# EAGLE design sub (EAGLE 9.6.2)
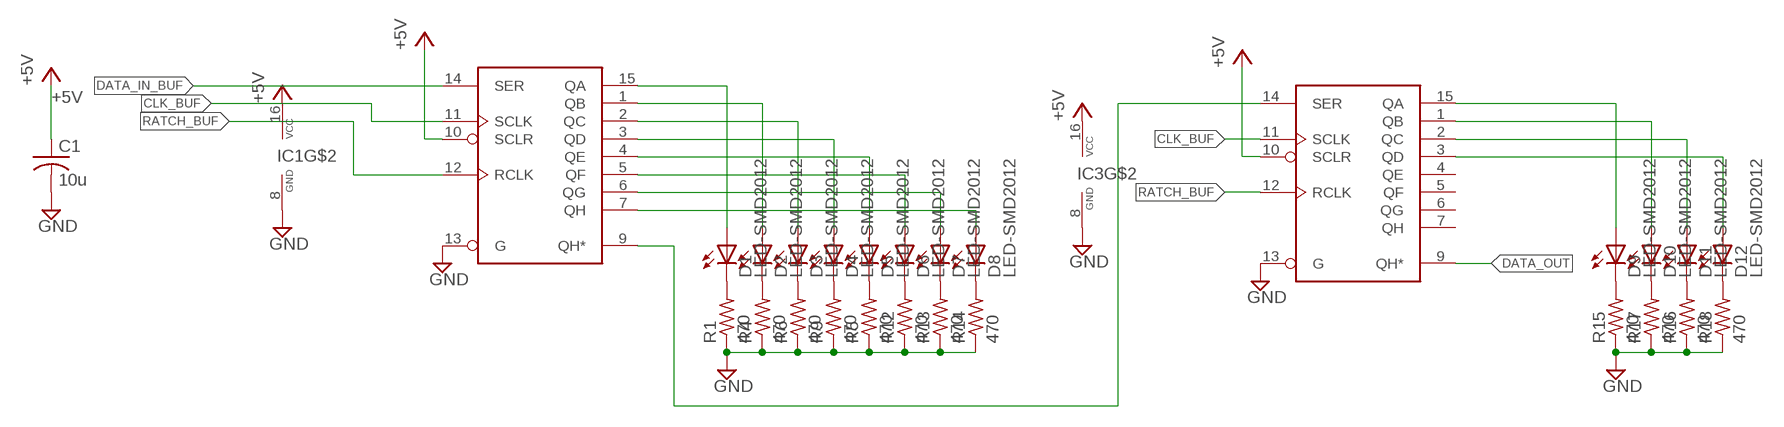
[diagram p0: schematic, sheet 1]

## Parts
C1  10u  C-2012  [2012-C]
D1  LED-SMD2012  [D2012]
D2  LED-SMD2012  [D2012]
D3  LED-SMD2012  [D2012]
D4  LED-SMD2012  [D2012]
D5  LED-SMD2012  [D2012]
D6  LED-SMD2012  [D2012]
D7  LED-SMD2012  [D2012]
D8  LED-SMD2012  [D2012]
D9  LED-SMD2012  [D2012]
D10  LED-SMD2012  [D2012]
D11  LED-SMD2012  [D2012]
D12  LED-SMD2012  [D2012]
IC1  74595AP  [SOP16]
IC3  74595AP  [SOP16]
R1  470  R-2012  [2012-R]
R4  470  R-2012  [2012-R]
R5  470  R-2012  [2012-R]
R6  470  R-2012  [2012-R]
R9  470  R-2012  [2012-R]
R12  470  R-2012  [2012-R]
R13  470  R-2012  [2012-R]
R14  470  R-2012  [2012-R]
R15  470  R-2012  [2012-R]
R16  470  R-2012  [2012-R]
R17  470  R-2012  [2012-R]
R18  470  R-2012  [2012-R]

## Nets
+5V: C1.1 IC1.10(SCLR) IC1.16(VCC) IC3.10(SCLR) IC3.16(VCC)
CLK_BUF: IC1.11(SCLK) IC3.11(SCLK)
DATA_IN_BUF: IC1.14(SER)
DATA_OUT: IC3.9(QH*)
GND: C1.2 IC1.8(GND) IC1.13(G) IC3.8(GND) IC3.13(G) R1.1 R4.1 R5.1 R6.1 R9.1 R12.1 R13.1 R14.1 R15.1 R16.1 R17.1 R18.1
N$1: D1.K R1.2
N$6: D5.K R5.2
N$7: D2.K R4.2
N$8: D3.K R6.2
N$12: D4.K R9.2
N$13: D6.K R12.2
N$14: D7.K R13.2
N$15: D8.K R14.2
N$16: D1.A IC1.15(QA)
N$17: D2.A IC1.1(QB)
N$18: D3.A IC1.2(QC)
N$19: D4.A IC1.3(QD)
N$20: D5.A IC1.4(QE)
N$21: D6.A IC1.5(QF)
N$22: D7.A IC1.6(QG)
N$23: D8.A IC1.7(QH)
N$24: D9.K R15.2
N$25: D10.K R17.2
N$26: D11.K R16.2
N$27: D12.K R18.2
N$28: D9.A IC3.15(QA)
N$29: D10.A IC3.1(QB)
N$30: D11.A IC3.2(QC)
N$31: D12.A IC3.3(QD)
N$32: IC1.9(QH*) IC3.14(SER)
RATCH_BUF: IC1.12(RCLK) IC3.12(RCLK)
Unconnected: IC3.4(QE) IC3.5(QF) IC3.6(QG) IC3.7(QH)

## Library data of the parts
C1 = Passive_Robotech:C
D1-D12 = Diode_Robotech:LED
IC1 IC3 = IC_Robotech:74*595AP
R1 R4-R6 R9 R12-R18 = Passive_Robotech:R

## Board
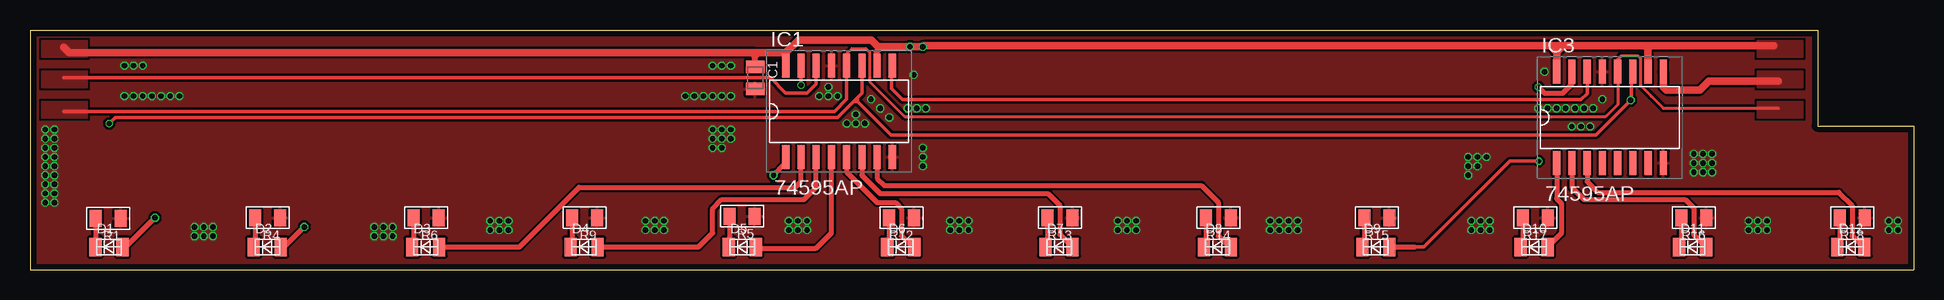
[diagram p1: board, top side]
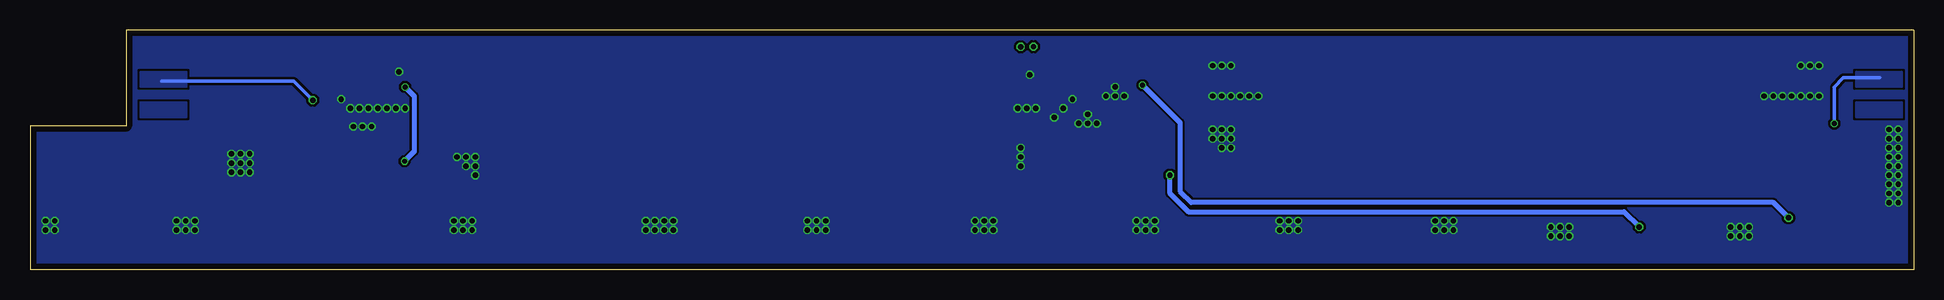
[diagram p2: board, bottom side, seen from below]

Size 157 x 20 mm. Coordinates in mm from the lower left corner, seen from the top.
Outline: 0,0 157,0 157,12 149,12 149,20 0,20 0,0
Copper layers (1*16): Top 0.07mm / dielectric 1.6mm / Bottom 0.07mm
Design rules "pcbcart2layer": minimum track width 6mil, minimum drill 0.4mm, track to track 0.2mm, track to pad 0.2mm, pad to pad 0.2mm, via to via 0.2mm, smd to smd 0.2mm, copper to edge 0.5mm, drill to drill 0.3mm, minimum pad ring 3mil, minimum via ring 3mil, stop-mask expansion 1mil, vias tented up to drill 1mm, thermal gap 10mil

### Footprints (pad centres in the part's own frame; a part is rotated, then mirrored left to right if it is on the bottom)
2012-C = smd 1.016 x 1.524: 1 -0.921,0; 2 0.921,0
D2012 = smd 1.016 x 1.524: A 1.127,0; K -1.127,0
SOP16 = smd 0.6 x 2: 1 0,0; 2 1.27,0; 3 2.54,0; 4 3.81,0; 5 5.08,0; 6 6.35,0; 7 7.62,0; 8 8.89,0; 9 8.89,7.62; 10 7.62,7.62; 11 6.35,7.62; 12 5.08,7.62; 13 3.81,7.62; 14 2.54,7.62; 15 1.27,7.62; 16 0,7.62
2012-R = smd 1 x 1.4: 1 -1.048,0; 2 1.048,0

### Placement (x,y rotation side)
C1  60.45,16 270 top
D1  6.58,1.88 0 top
D2  19.78,1.88 0 top
D3  32.98,1.88 0 top
D4  46.18,1.88 0 top
D5  59.38,1.88 0 top
D6  72.58,1.88 0 top
D7  85.78,1.88 0 top
D8  98.98,1.88 0 top
D9  112.18,1.88 0 top
D10  125.38,1.88 0 top
D11  138.58,1.88 0 top
D12  151.78,1.88 0 top
IC1  62.99,9.4 0 top
IC3  127.25,8.89 0 top
R1  6.52,4.27 180 top
R4  19.81,4.32 180 top
R5  59.35,4.44 180 top
R6  33.02,4.32 180 top
R9  46.23,4.32 180 top
R12  72.64,4.32 180 top
R13  85.85,4.32 180 top
R14  99.06,4.32 180 top
R15  112.27,4.32 180 top
R16  138.68,4.32 180 top
R17  125.48,4.32 180 top
R18  151.89,4.32 180 top

### Tracks (layer width: path | path; a pad name or v marks a point on that pad's centre or on a via)
+5V  (via drill 0.45)
  Top 0.508: IC1.10 70.61,18.29 70.8,18.48 | C1.1 60.45,17.78 | 60.45,17.78 60.45,18.09 | 60.45,17.78 60.76,18.09 60.96,18.09 | 59.94,18.09 60.15,18.09 60.45,17.78
  Top 0.61: IC3.10 134.87,18.43 | 134.62,18.68 134.87,18.43 | 127.8,18.68 134.62,18.68 | 127.8,18.68 127.36,18.68 | 127.36,18.68 126.71,18.68 | 62.99,18.09 64.06,19.15 70.13,19.15 70.8,18.48 70.93,18.61 v73.36,18.61 74.41,18.61 v74.42,18.59 74.51,18.68 126.71,18.68 | IC3.16 127.25,18.14 | 127.25,18.14 127.25,18.58 127.36,18.68 | 127.25,18.14 127.8,18.68 | 127.25,18.14 126.71,18.68 | 134.62,18.68 135.13,18.68 | 135.13,18.68 145.36,18.68 | 134.87,18.43 135.13,18.68 | 2.79,18.54 3.25,18.09 59.94,18.09 60.45,18.09 60.96,18.09 62.99,18.09 | IC1.16 62.99,18.09
  pour Top: 143.97,19.05 143.97,17.78 147.78,17.78 147.78,19.05
  pour Top: 0.97,19.05 0.97,17.78 4.78,17.78 4.78,19.05
CLK_BUF  (via drill 0.4, 0.45)
  Top 0.305: IC1.11 69.34,14.73 68.97,14.36 | 68.65,14.03 67.32,12.7 7.12,12.7 v6.6,12.19 | 68.65,14.03 68.81,14.2 | 68.81,14.2 68.97,14.36 | IC3.11 133.49,16.4 133.49,14.2 v133.43,14.14 130.54,11.25 71.76,11.25 68.97,14.03 | 68.97,14.03 68.81,14.2 | 68.97,14.36 68.97,14.03 | 68.65,14.03 68.97,14.03
  Bottom 0.305: v133.43,14.14 135.04,15.75 146,15.75 | v6.6,12.19 6.6,15.24 5.84,16 2.79,16
  pour Bottom: 143.97,16.51 143.97,15.24 147.78,15.24 147.78,16.51
  pour Bottom: 0.97,16.51 0.97,15.24 4.78,15.24 4.78,16.51
DATA_IN_BUF
  Top 0.305: IC1.14 65.53,15.49 64.77,14.73 62.99,14.73 61.72,16 2.79,16
  pour Top: 0.97,16.51 0.97,15.24 4.78,15.24 4.78,16.51
DATA_OUT
  Top 0.61: IC3.9 136.14,15.24 136.4,14.99 139.19,14.99 139.95,15.75 145.75,15.75
  pour Top: 143.97,16.51 143.97,15.24 147.78,15.24 147.78,16.51
GND  (via drill 0.45)
  other vias: 38.35,4.06 39.12,4.06 38.35,3.3 39.12,3.3 39.88,3.3 39.88,4.06 13.72,3.56 14.48,3.56 15.24,3.56 13.72,2.79 14.48,2.79 15.24,2.79 28.7,2.79 29.46,2.79 30.23,2.79 28.7,3.56 29.46,3.56 30.23,3.56 51.31,3.3 52.07,3.3 52.83,3.3 51.31,4.06 52.07,4.06 52.83,4.06 63.25,4.06 64.01,4.06 64.77,4.06 63.25,3.3 64.01,3.3 64.77,3.3 76.71,4.06 77.47,4.06 78.23,4.06 76.71,3.3 77.47,3.3 78.23,3.3 90.68,4.06 91.44,4.06 92.2,4.06 90.68,3.3 91.44,3.3 92.2,3.3 103.38,4.06 104.14,4.06 104.9,4.06 105.66,4.06 103.38,3.3 104.14,3.3 104.9,3.3 105.66,3.3 143.26,4.06 144.02,4.06 144.78,4.06 143.26,3.3 144.02,3.3 144.78,3.3 120.14,4.06 120.9,4.06 121.67,4.06 120.14,3.3 120.9,3.3 121.67,3.3 130.3,13.46 129.54,13.46 128.78,13.46 131.06,14.22 128.02,13.46 73.66,16.26 126.24,16.51 154.94,4.06 154.94,3.3 155.7,4.06 155.7,3.3 127.25,13.46 126.49,13.46 125.73,13.46 73.15,13.46 73.91,13.46 74.68,13.46 68.07,12.19 69.6,12.19 68.83,12.19 68.83,12.95 128.52,11.94 129.29,11.94 130.05,11.94 56.9,11.68 56.9,10.92 56.9,10.16 57.66,10.16 57.66,10.92 57.66,11.68 58.42,11.68 58.42,10.92 65.79,14.48 66.55,14.48 67.31,14.48 66.55,15.24 70.1,14.22 70.87,13.46 71.63,12.7 138.68,9.65 138.68,8.89 138.68,8.13 139.45,8.13 139.45,8.89 139.45,9.65 140.21,9.65 140.21,8.89 140.21,8.13 1.27,11.68 1.27,10.92 1.27,10.16 1.27,9.4 1.27,8.64 1.27,7.87 1.27,7.11 1.27,6.35 1.27,5.59 2.03,11.68 2.03,10.92 2.03,10.16 2.03,9.4 2.03,8.64 2.03,7.87 2.03,7.11 2.03,6.35 2.03,5.59 7.87,14.48 8.64,14.48 9.4,14.48 10.16,14.48 10.92,14.48 11.68,14.48 12.45,14.48 7.87,17.02 8.64,17.02 9.4,17.02 56.9,17.02 57.66,17.02 58.42,17.02 56.9,14.48 57.66,14.48 58.42,14.48 56.13,14.48 55.37,14.48 54.61,14.48 74.42,10.16 74.42,9.4 74.42,8.64 119.89,9.4 120.65,9.4 121.41,9.4 119.89,8.64 120.65,8.64 119.89,7.87
  pour Top (rank 2): 0,0 0,20 149,20 149,12 157,12 157,0
  pour Bottom (rank 2): 157,12 149,12 149,20 0,20 0,0 157,0
  pour Bottom: 143.97,19.05 143.97,17.78 147.78,17.78 147.78,19.05
  pour Bottom: 0.97,19.05 0.97,17.78 4.78,17.78 4.78,19.05
N$1
  Top 0.406: R1.2 5.47,1.88 D1.K
N$6
  Top 0.406: R5.2 58.3,1.88 D5.K
N$7
  Top 0.406: R4.2 18.76,1.88 D2.K
N$8
  Top 0.406: R6.2 31.97,1.88 D3.K
N$12
  Top 0.406: R9.2 45.18,1.88 D4.K
N$13
  Top 0.406: R12.2 71.6,1.88 D6.K
N$14
  Top 0.406: R13.2 84.8,1.88 D7.K
N$15
  Top 0.406: R14.2 98.01,1.88 D8.K
N$16  (via drill 0.4, 0.45)
  Top 0.305: IC1.15 v64.26,15.38
  Top 0.406: D1.A 7.98,1.88 v10.41,4.32
  Bottom 0.406: v10.41,4.32 11.68,5.59 60.2,5.59 61.14,6.53 61.14,12.26 v64.26,15.38
N$17  (via drill 0.45)
  Top 0.406: D2.A 21.18,1.88 v22.86,3.56 | v61.98,7.87 62.99,8.89 IC1.1
  Bottom 0.406: v22.86,3.56 24.13,4.83 60.45,4.83 61.98,6.35 v61.98,7.87
N$18
  Top 0.406: D3.A 40.79,1.88 45.77,6.86 63.75,6.86 64.26,7.37 IC1.2
N$19
  Top 0.406: D4.A 55.73,1.88 56.9,3.05 56.9,5.08 57.66,5.84 64.52,5.84 65.53,6.86 IC1.3
N$20
  Top 0.406: D5.A 60.61,1.78 65.53,1.78 66.8,3.05 IC1.4
N$21
  Top 0.406: IC1.5 68.07,8.13 70.61,5.59 72.14,5.59 72.64,5.08 72.64,2.79 73.56,1.88 D6.A
N$22
  Top 0.406: IC1.6 69.34,7.87 70.87,6.35 84.84,6.35 85.85,5.33 85.85,2.93 D7.A
N$23
  Top 0.406: IC1.7 70.61,7.62 71.22,7.01 97.64,7.01 99.06,5.59 99.06,2.79 99.97,1.88 D8.A
N$24
  Top 0.406: R15.2 111.22,1.88 D9.K
N$25
  Top 0.406: R17.2 124.43,1.88 D10.K
N$26
  Top 0.406: R16.2 137.64,1.88 D11.K
N$27
  Top 0.406: R18.2 150.84,1.88 D12.K
N$28  (via drill 0.4)
  Top 0.305: 115.42,1.88 116.2,1.88 123.37,9.04 v125.78,9.04
  Top 0.406: D9.A 115.42,1.88 | v125.73,15.24 126.24,14.73 127.76,14.73 128.52,15.49 IC3.15
  Bottom 0.406: v125.73,15.24 124.97,14.48 124.97,9.86 v125.78,9.04
N$29
  Top 0.406: D10.A 127.63,3.01 127.63,5.52 127.25,5.9 IC3.1
N$30
  Top 0.406: IC3.2 128.52,6.86 129.54,5.84 137.97,5.84 138.68,5.13 138.68,2.9 D11.A
N$31
  Top 0.406: IC3.3 129.79,7.32 130.66,6.45 150.77,6.45 151.89,5.33 151.89,2.79 152.81,1.88 D12.A
N$32
  Top 0.305: IC3.14 129.79,14.68 129.29,14.17 72.75,14.17 71.83,15.09 71.83,16.97 IC1.9
NC
  pour Bottom: 143.97,13.97 143.97,12.7 147.78,12.7 147.78,13.97
  pour Bottom: 0.97,13.97 0.97,12.7 4.78,12.7 4.78,13.97
RATCH_BUF
  Top 0.254: IC1.12 68.07,18.01 68.5,18.44 69.68,18.44 69.98,18.14 69.98,15.69 72.9,12.77 131.35,12.77 132.33,13.76 IC3.12 132.33,17.53 132.65,17.84 134.04,17.84 134.24,17.63 134.24,15.38 135.13,14.49 135.13,14.48 136.14,13.46 145.75,13.46
  Top 0.305: IC1.12 68.07,14.22 67.06,13.21 2.79,13.21
  pour Top: 143.97,13.97 143.97,12.7 147.78,12.7 147.78,13.97
  pour Top: 0.97,13.97 0.97,12.7 4.78,12.7 4.78,13.97

### Text on the board
tValues: Uplight